# EAGLE schematic hr_subsystem (EAGLE 9.6.1)
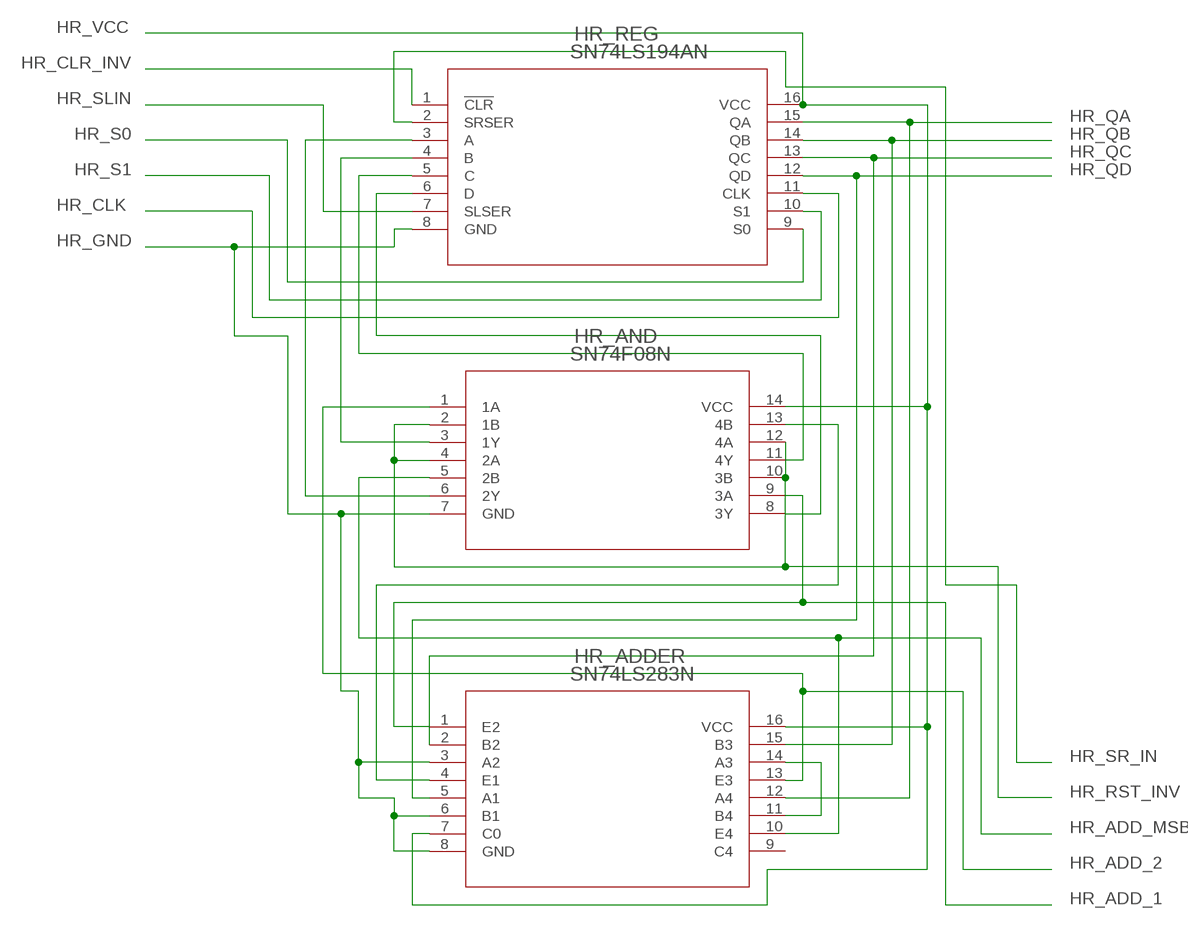
[diagram p0: schematic, sheet 1]

## Parts
HR_ADDER  SN74LS283N  [N16]
HR_AND  SN74F08N  [N14]
HR_REG  SN74LS194AN  [N16]

## Nets
HR_ADD_1: HR_ADDER.1(E2) HR_AND.9(3A)
HR_ADD_2: HR_ADDER.13(E3) HR_AND.1(1A)
HR_ADD_MSB: HR_ADDER.10(E4) HR_AND.5(2B)
HR_CLK: HR_REG.11(CLK)
HR_CLR_INV: HR_REG.1(!CLR)
HR_GND: HR_ADDER.3(A2) HR_ADDER.6(B1) HR_ADDER.8(GND) HR_AND.7(GND) HR_REG.8(GND)
HR_QA: HR_ADDER.12(A4) HR_REG.15(QA)
HR_QB: HR_ADDER.15(B3) HR_REG.14(QB)
HR_QC: HR_ADDER.2(B2) HR_REG.13(QC)
HR_QD: HR_ADDER.5(A1) HR_REG.12(QD)
HR_RST_INV: HR_AND.2(1B) HR_AND.4(2A) HR_AND.10(3B) HR_AND.12(4A)
HR_S0: HR_REG.9(S0)
HR_S1: HR_REG.10(S1)
HR_SLIN: HR_REG.7(SLSER)
HR_SR_IN: HR_REG.2(SRSER)
HR_VCC: HR_ADDER.7(C0) HR_ADDER.16(VCC) HR_AND.14(VCC) HR_REG.16(VCC)
N$1: HR_AND.6(2Y) HR_REG.3(A)
N$2: HR_AND.3(1Y) HR_REG.4(B)
N$3: HR_AND.11(4Y) HR_REG.5(C)
N$4: HR_AND.8(3Y) HR_REG.6(D)
N$5: HR_ADDER.4(E1) HR_AND.13(4B)
N$14: HR_ADDER.11(B4) HR_ADDER.14(A3)
Unconnected: HR_ADDER.9(C4)

## Library data of the parts
HR_ADDER = sn74ls283n:SN74LS283N: 4-Bit Full Adder w/ Fast Carry; DATASHEET_URL: http://www.ti.com/lit/gpn/SN74LS283; DESCRIPTION: 4-Bit Binary Full Adders With Fast Carry; FAMILY_NAME: ADDER; GENERIC_PART_NUMBER: SN74LS283; INDUSTRY_STD_PKG_TYPE: PDIP; MANUFACTURER: Texas Instruments; PACKAGE_DESIGNATOR: N; PIN_COUNT: 16
HR_AND = sn74f08n:SN74F08N: Quad 2-In Positive AND; DATASHEET_URL: http://www.ti.com/lit/gpn/SN74F08; DESCRIPTION: Quadruple 2-Input Positive-AND Gate; FAMILY_NAME: AND GATE; GENERIC_PART_NUMBER: SN74F08; INDUSTRY_STD_PKG_TYPE: PDIP; MANUFACTURER: Texas Instruments; PACKAGE_DESIGNATOR: N; PIN_COUNT: 14
HR_REG = sn74ls194an:SN74LS194AN: 4-Bit BiDir. Universal Shift Register; DATASHEET_URL: http://www.ti.com/lit/gpn/SN74LS194A; DESCRIPTION: Bidirectional universal shift registers; FAMILY_NAME: SHIFT REGISTER; GENERIC_PART_NUMBER: SN74LS194A; INDUSTRY_STD_PKG_TYPE: PDIP; MANUFACTURER: Texas Instruments; PACKAGE_DESIGNATOR: N; PIN_COUNT: 16